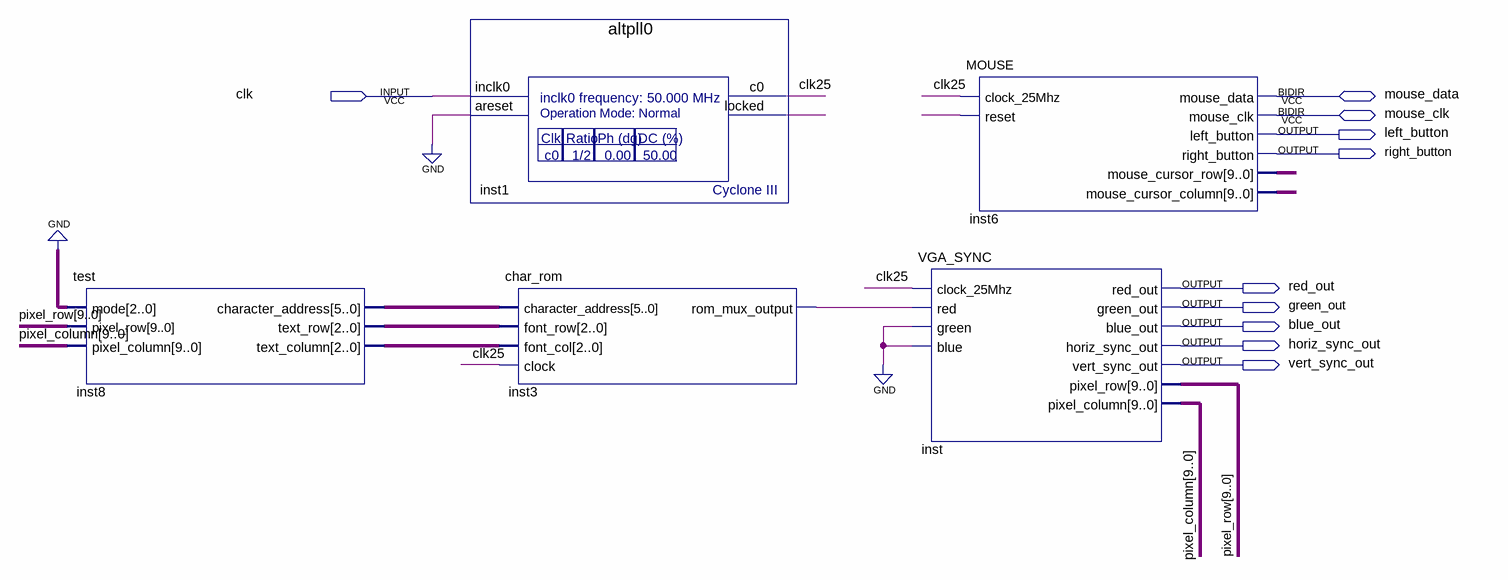
[diagram p0: schematic sheet]
// Quartus schematic text_example.bdf as structural Verilog: 5 symbols, 10 pins
module text_example (
  input  clk,
  inout  mouse_data,
  inout  mouse_clk,
  output left_button,
  output right_button,
  output red_out,
  output green_out,
  output blue_out,
  output horiz_sync_out,
  output vert_sync_out
);

  wire clk25, inst1_locked, inst3_rom_mux_output, undriven;
  wire [2:0] inst8_text_column, inst8_text_row;
  wire [5:0] inst8_character_address;
  wire [9:0] inst6_mouse_cursor_column, inst6_mouse_cursor_row, pixel_column, pixel_row;

  test inst8 (
    .mode(3'b000), .pixel_row(pixel_row), .pixel_column(pixel_column),
    .character_address(inst8_character_address), .text_row(inst8_text_row), .text_column(inst8_text_column));
  altpll0 inst1 (.inclk0(clk), .areset(1'b0), .c0(clk25), .locked(inst1_locked));
  char_rom inst3 (
    .character_address(inst8_character_address), .font_row(inst8_text_row), .font_col(inst8_text_column),
    .clock(clk25), .rom_mux_output(inst3_rom_mux_output));
  MOUSE inst6 (
    .clock_25Mhz(clk25), .reset(undriven), .left_button(left_button), .right_button(right_button),
    .mouse_cursor_row(inst6_mouse_cursor_row), .mouse_cursor_column(inst6_mouse_cursor_column),
    .mouse_data(mouse_data), .mouse_clk(mouse_clk));
  VGA_SYNC inst (
    .clock_25Mhz(clk25), .red(inst3_rom_mux_output), .green(1'b0), .blue(1'b0), .red_out(red_out),
    .green_out(green_out), .blue_out(blue_out), .horiz_sync_out(horiz_sync_out),
    .vert_sync_out(vert_sync_out), .pixel_row(pixel_row), .pixel_column(pixel_column));
endmodule
